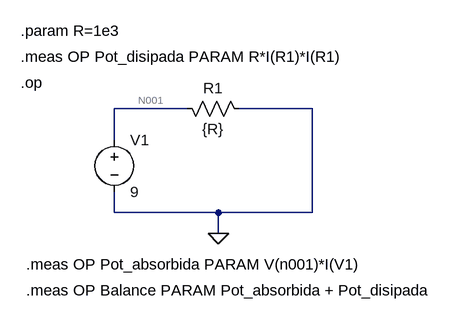
[diagram p0: schematic Circuito_1_basico.asc]
Circuito_1_basico.asc, the LTspice schematic file:
Version 4
SHEET 1 880 680
WIRE 144 80 32 80
WIRE 336 80 224 80
WIRE 32 128 32 80
WIRE 32 240 32 208
WIRE 192 240 32 240
WIRE 336 240 336 80
WIRE 336 240 192 240
WIRE 192 272 192 240
FLAG 192 272 0
SYMBOL voltage 32 112 R0
WINDOW 123 0 0 Left 0
WINDOW 39 0 0 Left 0
SYMATTR InstName V1
SYMATTR Value 9
SYMBOL res 128 64 M90
WINDOW 0 0 56 VBottom 2
WINDOW 3 32 56 VTop 2
SYMATTR InstName R1
SYMATTR Value {R}
TEXT -112 40 Left 2 !.op
TEXT -112 0 Left 2 !.meas OP Pot_disipada PARAM R*I(R1)*I(R1)
TEXT -112 -40 Left 2 !.param R=1e3
TEXT -104 320 Left 2 !.meas OP Pot_absorbida PARAM V(n001)*I(V1)
TEXT -104 360 Left 2 !.meas OP Balance PARAM Pot_absorbida + Pot_disipada

The netlist it stands for:
* Circuito_1_basico.asc
V1 N001 0 9
R1 N001 0 {R}
.op
.meas OP Pot_disipada PARAM R*I(R1)*I(R1)
.param R=1e3
.meas OP Pot_absorbida PARAM V(n001)*I(V1)
.meas OP Balance PARAM Pot_absorbida + Pot_disipada
.backanno
.end